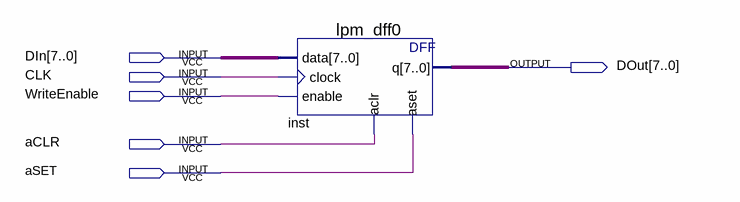
[diagram p0: schematic sheet]
// Quartus schematic Dff_8bit.bdf as structural Verilog: 1 symbols, 6 pins
module Dff_8bit (
  input  [7:0] DIn,
  input  CLK,
  input  WriteEnable,
  input  aCLR,
  input  aSET,
  output [7:0] DOut
);

  lpm_dff0 inst (.data(DIn), .clock(CLK), .enable(WriteEnable), .aclr(aCLR), .aset(aSET), .q(DOut));
endmodule
